# Altium schematic sheet [09] - ETHERNET.SchDoc
size A2; DocumentNumber: 9; SheetNumber: 9; SheetTotal: 13; NameAuthor: Angle Vu
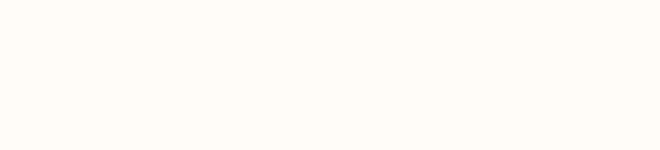
[diagram p0: [09] - ETHERNET.SchDoc]

## Notes on the sheet
- CLOCKS (CPU & PCIE)
- Designed By
- Checked By
- Page Name:
- Size:
- A2
- Company:
- Address:
- Sheet:
- /